# Altium project ClockController.PrjPcb
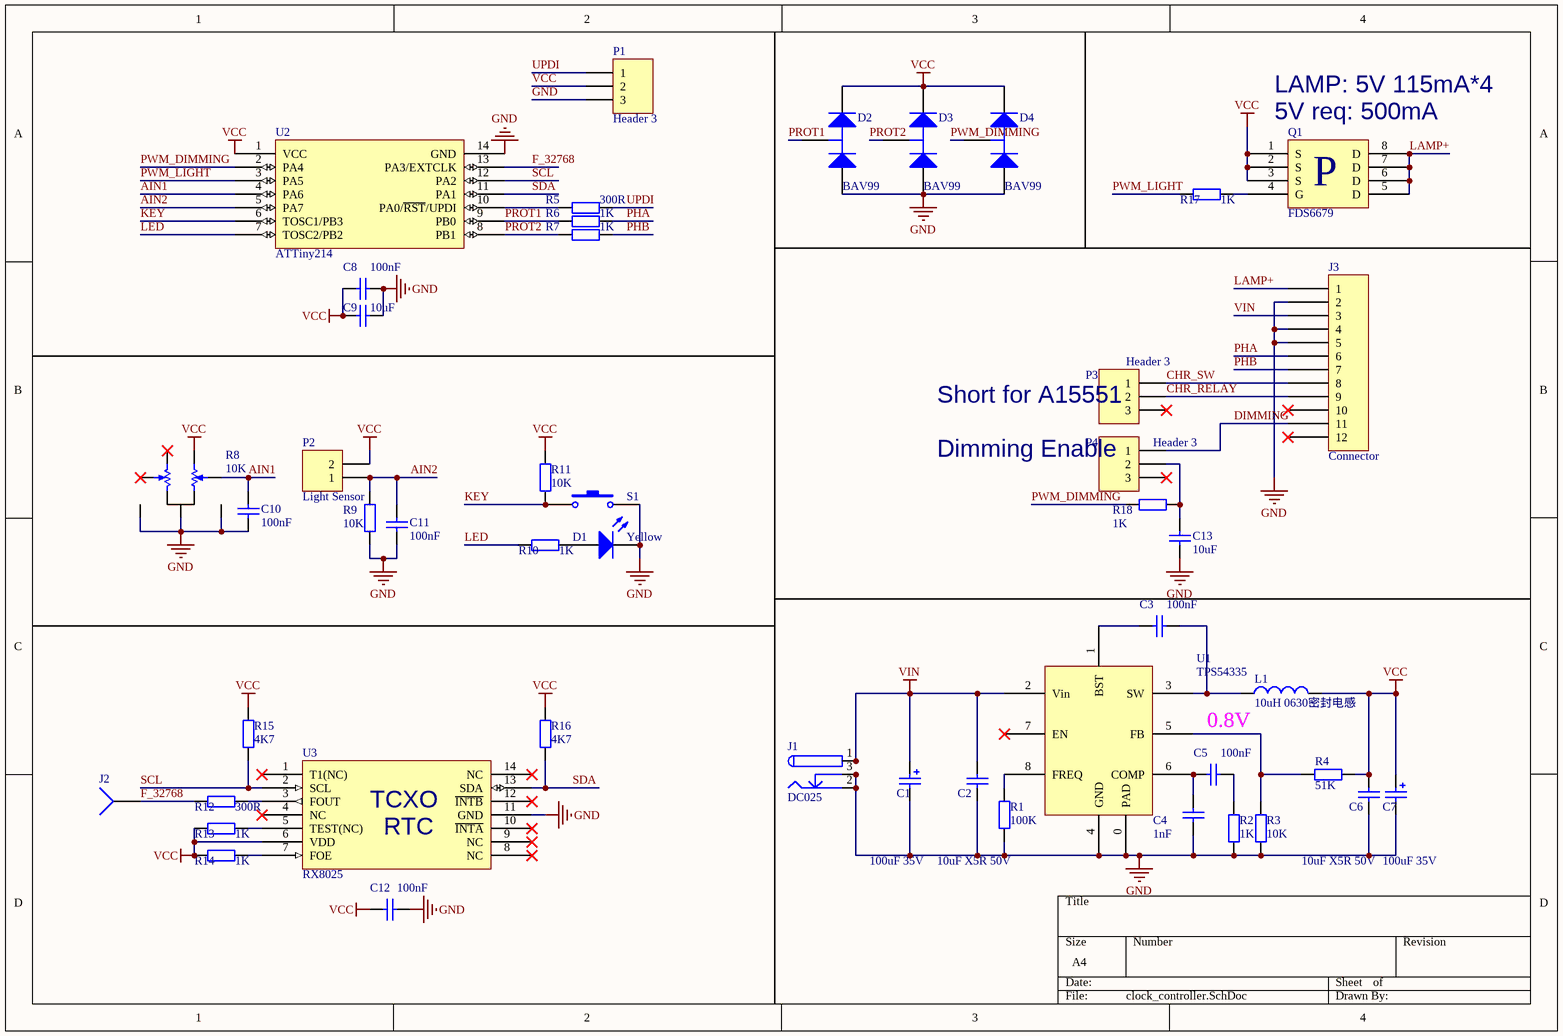
[diagram p0: clock_controller.SchDoc]
1 sheet, 48 parts. Net scope: global (net labels, ports and power ports of the same name join across sheets).
Board file: clock_controller.PcbDoc

## Sheet clock_controller.SchDoc
size A4

### Parts
C1  100uF 35V  [C6380POL]
C2  10uF X5R 50V  [C1206]
C3  100nF  [C0603]
C4  1nF  [C0603]
C5  100nF  [C0603]
C6  10uF X5R 50V  [C1206]
C7  100uF 35V  [C6380POL]
C8  100nF  [C0603]
C9  10uF  [C1206]
C10  100nF  [C0603]
C11  100nF  [C0603]
C12  100nF  [C0603]
C13  10uF  [C1206]
D1  Yellow  [LED0805]
D2  BAV99  [SOT23]
D3  BAV99  [SOT23]
D4  BAV99  [SOT23]
J1  DC025  [DC025M]
J2  Socket  [PIN1]  (value not drawn)
J3  Connector  [MS27034H12B12PN]
L1  10uH 0630密封电感  [Inductor0630]
P1  Header 3  [HDR1X3]
P2  Light Sensor  [HDR1X2]
P3  Header 3  [HDR1X3]
P4  Header 3  [HDR1X3]
Q1  FDS6679  [SO-8]
R1  100K  [R0603]
R2  1K  [R0603]
R3  10K  [R0603]
R4  51K  [R0603]
R5  300R  [R0603]
R6  1K  [R0603]
R7  1K  [R0603]
R8  10K  [RK10J]
R9  10K  [R0603]
R10  1K  [R0603]
R11  10K  [R0603]
R12  300R  [R0603]
R13  1K  [R0603]
R14  1K  [R0603]
R15  4K7  [R0603]
R16  4K7  [R0603]
R17  1K  [R0603]
R18  1K  [R0603]
S1  SW-PB  [BUTTON_SMT]  (value not drawn)
U1  TPS54335  [SO-8-Thermal]
U2  ATTiny214  [SO-14]
U3  RX8025  [SO-14]

### Nets
GND: C1.2 C2.1 C4.1 C6.1 C7.2 C8.2 C9.2 C10.1 C11.1 C12.2 C13.1 D1.2(K) D2.3(A) D3.3(A) D4.3(A) J1.2 J1.2A J1.2B J1.3 J1.3A J1.3B J3.2 J3.4 J3.5 P1.3 R1.2 R2.2 R3.2 R8.1(-) R8.6(-) R8.7(-) R9.1 S1.2 U1.0(PAD) U1.4(GND) U2.14(GND) U3.11(GND)
VCC: C6.2 C7.1 C8.1 C9.1 C12.1 D2.2(K) D3.2(K) D4.2(K) L1.2 P1.2 P2.2 Q1.1(S) Q1.2(S) Q1.3(S) R4.2 R8.4 R11.1 R13.2 R14.2 R15.1 R16.1 U2.1(VCC) U3.6(VDD)
VIN: C1.1 C2.2 J1.1 J1.1A J1.1B J3.3 U1.2(Vin)
AIN1: C10.2 R8.3 U2.4(PA6)
AIN2: C11.2 P2.1 R9.2 U2.5(PA7)
CHR_RELAY: J3.9 P3.2
CHR_SW: J3.8 P3.1
DIMMING: J3.11 P4.1
F_32768: J2.1 R12.2 U2.13(PA3/EXTCLK)
KEY: R11.2 S1.1 U2.6(TOSC1/PB3)
LAMP+: J3.1 Q1.5(D) Q1.6(D) Q1.7(D) Q1.8(D)
LED: R10.2 U2.7(TOSC2/PB2)
PHA: J3.6 R6.1
PHB: J3.7 R7.1
PROT1: D2.1(C) R6.2 U2.9(PB0)
PROT2: D3.1(C) R7.2 U2.8(PB1)
PWM_DIMMING: D4.1(C) R18.1 U2.2(PA4)
PWM_LIGHT: R17.2 U2.3(PA5)
SCL: R15.2 U2.12(PA2) U3.2(SCL)
SDA: R16.2 U2.11(PA1) U3.13(SDA)
UPDI: P1.1 R5.1
NetC3_1: C3.1 U1.1(BST)
NetC3_2: C3.2 L1.1 U1.3(SW)
NetC4_2: C4.2 C5.1 U1.6(COMP)
NetC5_2: C5.2 R2.1
NetC13_2: C13.2 P4.2 R18.2
NetD1_1: D1.1(A) R10.1
NetQ1_4: Q1.4(G) R17.1
NetR1_1: R1.1 U1.8(FREQ)
NetR3_1: R3.1 R4.1 U1.5(FB)
NetR5_2: R5.2 U2.10(PA0/~{RST}/UPDI)
NetR12_1: R12.1 U3.3(FOUT)
NetR13_1: R13.1 U3.5(TEST(NC))
NetR14_1: R14.1 U3.7(FOE)

Not connected (* = marked no-connect by the designer): J3 10* 12*; P3 3*; P4 3*; R8 2* 5*; U1 7(EN)*; U3 1(T1(NC))* 4(NC)* 8(NC)* 9(NC)* 10(~{INTA})* 12(~{INTB})* 14(NC)*

### Notes on the sheet
- LAMP: 5V 115mA*4
- (near Q1) 5V req: 500mA
- (near P3) Short for A15551
- Dimming Enable
- (near L1) 0.8V
- (in symbol FDS6679) P
- (in symbol RX8025T) TCXO; RTC

### Library data of the parts
C1 C7 = Cap Pol2: Polarized Capacitor (Axial); Published: 8-Jun-2000; LatestRevisionDate: 17-Jul-2002; LatestRevisionNote: Re-released for DXP Platform.; PackageReference: POLAR0.8; Publisher: Altium Limited; PackageDescription: Polarized Capacitor; 2 Leads; Value: 100uF 35V
C2-C6 C8-C13 = Cap: Capacitor; Published: 8-Jun-2000; LatestRevisionDate: 17-Jul-2002; LatestRevisionNote: Re-released for DXP Platform.; PackageReference: RAD-0.3; Publisher: Altium Limited; PackageDescription: Radial Cap, Thru-Hole; 2 Leads; 0.3 in Pin Spacing
  C2 C6: Value: 10uF X5R 50V
  C3 C5 C8 C10-C12: Value: 100nF
  C4: Value: 1nF
  C9 C13: Value: 10uF
D1 = LED0: Typical INFRARED GaAs LED; Published: 8-Jun-2000; LatestRevisionDate: 08-Jul-2005; LatestRevisionNote: Mech Layer 1 removed.; PackageReference: LED-0; Publisher: Altium Limited; PackageDescription: LED; 2 Leads
D2-D4 = BAV99: SOT23 Silicon Planar High-Speed Switching Series Diode Pair; Published: 8-Jun-2000; LatestRevisionDate: 17-Jul-2002; LatestRevisionNote: Re-released for DXP Platform.; DatasheetVersion: May-1995; PackageVersion: 1996; PackageReference: SOT23; Publisher: Altium Limited; PackageDescription: SOT-23; 3 Leads; Body 3.1 x 2.5 mm, inc. leads (LxW max), Alternate Lead Configuration; ComponentLink1Description: Manufacturer Link; ComponentLink1URL: http://www.zetex.com/; ComponentLink2Description: Datasheet; ComponentLink2URL: www.zetex.com/3.0/pdf/BAV99A.pdf
J1 = DC025: CON,PWR2.5 DC025M 2.1mm芯; Part Number-IAC: 6Y49A0001501; Part Name: DC-025M; General: 2.1mm
J3 = CON_MS27034H12B12PN
L1 = Inductor: Code_IEC: 1005; Published: 8-Jun-2000; LatestRevisionDate: 29-May-2009; LatestRevisionNote: IPC-7351 Footprint Added.; PackageReference: 0402-A; Publisher: Altium Limited; PackageDescription: Chip Inductor; Code_JEITA: 0402; Value: 10uH 0630密封电感
P1 P3 P4 = Header 3: Header, 3-Pin; LatestRevisionDate: 17-Jul-2002; LatestRevisionNote: Re-released for DXP Platform.; Publisher: Altium Limited
P2 = Header 2: Header, 2-Pin; LatestRevisionDate: 17-Jul-2002; LatestRevisionNote: Re-released for DXP Platform.; Publisher: Altium Limited
R1-R7 R9-R18 = Res2: Resistor; Published: 8-Jun-2000; LatestRevisionDate: 17-Jul-2002; LatestRevisionNote: Re-released for DXP Platform.; PackageReference: AXIAL-0.4; Publisher: Altium Limited; PackageDescription: Axial Device, Thru-Hole; 2 Leads; 0.4 in Pin Spacing
  R1: Value: 100K
  R2 R6 R7 R10 R13 R14 R17 R18: Value: 1K
  R3 R9 R11: Value: 10K
  R4: Value: 51K
  R5 R12: Value: 300R
  R15 R16: Value: 4K7
R8 = RK10J: Square Trimming Potentiometer; Published: 17-Dec-2003; DatasheetVersion: Oct-2003; PackageReference: POT4MM-2; Publisher: Altium Limited; PackageDescription: Square Trimming Potentiometer; ComponentLink1Description: Manufacturer Link; ComponentLink1URL: http://bourns.com/2/search.html
S1 = SW-PB: Switch; Published: 24-Mar-1999; LatestRevisionDate: 17-Jul-2002; LatestRevisionNote: Re-released for DXP Platform.; PackageReference: SPST-2; Publisher: Altium Limited; PackageDescription: Switch; 2 Leads
U3 = RX8025T
J2 = Socket: LatestRevisionDate: 17-Jul-2002; LatestRevisionNote: Re-released for DXP Platform.; Publisher: Altium Limited